# Altium schematic sheet S05_Display.SchDoc
size A4
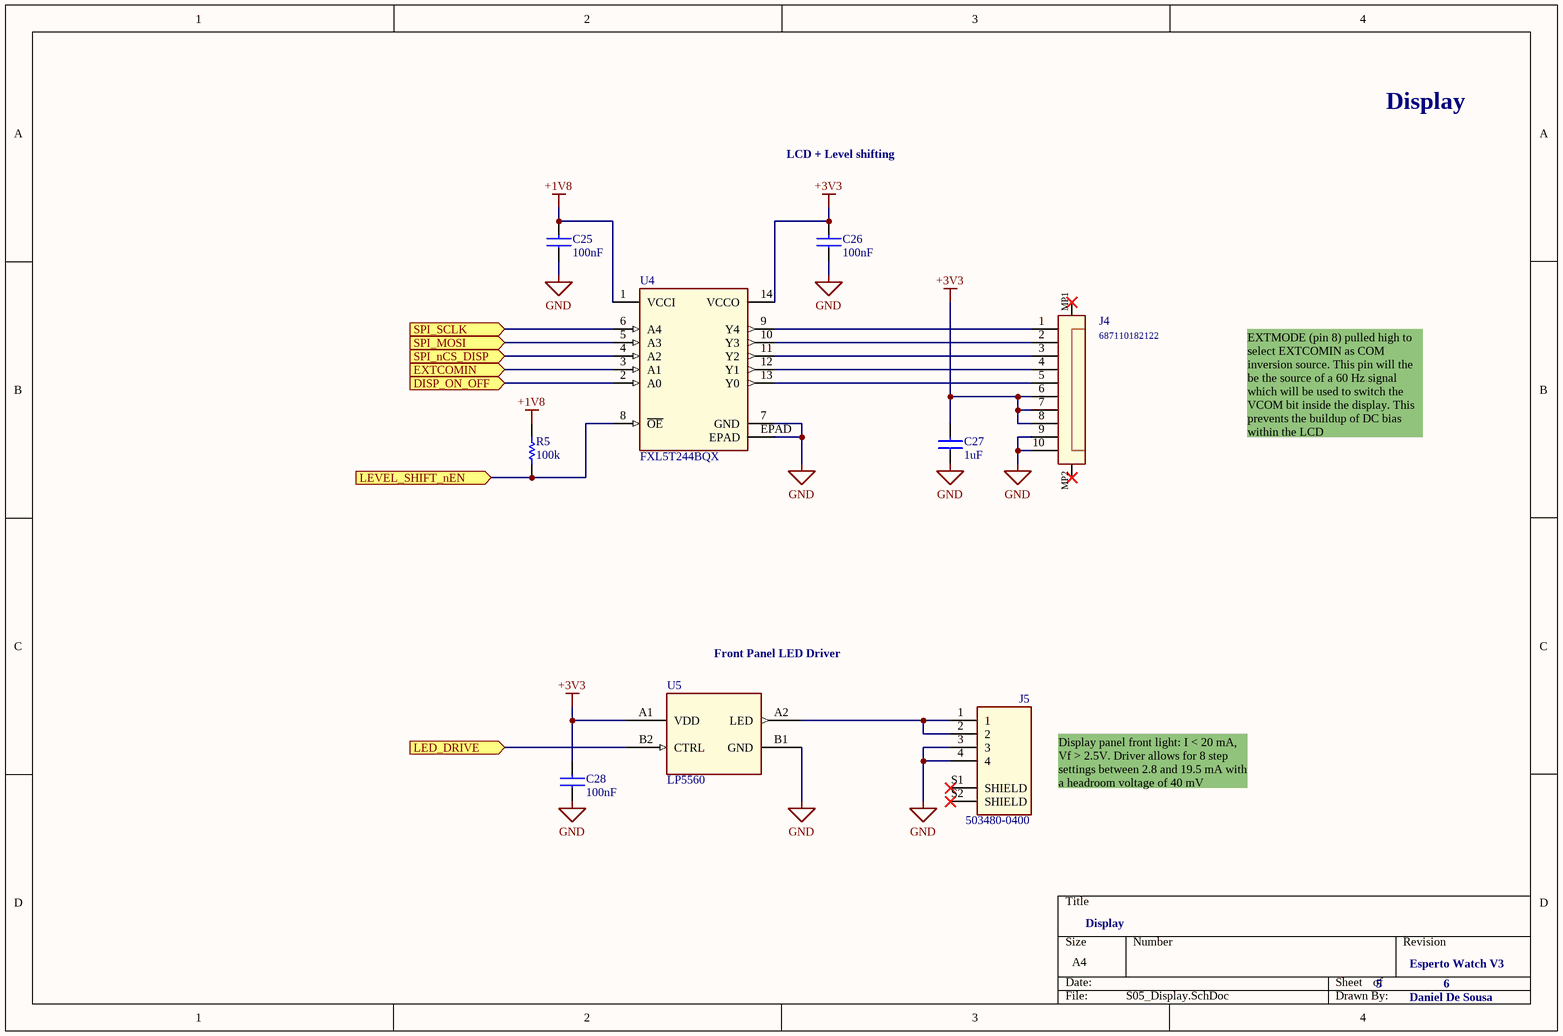
[diagram p0: S05_Display.SchDoc]

## Parts
C25  100nF  [CC_1005_0402_N]
C26  100nF  [CC_1005_0402_N]
C27  1uF  [CC_1005_0402_N]
C28  100nF  [CC_1005_0402_N]
J4  687110182122  [687110182122]
J5  503480-0400  [503480-0400]
R5  100k  [RC_1005_0402_N]
U4  FXL5T244BQX  [FXL5T244BQX]
U5  LP5560  [LP5560]

## Ports
DISP_ON_OFF (in), EXTCOMIN (in), LED_DRIVE (in), LEVEL_SHIFT_nEN (in), SPI_MOSI (in), SPI_nCS_DISP (in), SPI_SCLK (in)

## Nets
+1V8: C25.2 R5.2 U4.1(VCCI)
+3V3: C26.2 C27.2 C28.2 J4.6 J4.7 J4.8 U4.14(VCCO) U5.A1(VDD)
GND: C25.1 C26.1 C27.1 C28.1 J4.9 J4.10 J5.3 J5.4 U4.7(GND) U4.EPAD U5.B1(GND)
DISP_ON_OFF: U4.2(A0) ; port DISP_ON_OFF
EXTCOMIN: U4.3(A1) ; port EXTCOMIN
LED_DRIVE: U5.B2(CTRL) ; port LED_DRIVE
LEVEL_SHIFT_nEN: R5.1 U4.8(~{OE}) ; port LEVEL_SHIFT_nEN
SPI_MOSI: U4.5(A3) ; port SPI_MOSI
SPI_nCS_DISP: U4.4(A2) ; port SPI_nCS_DISP
SPI_SCLK: U4.6(A4) ; port SPI_SCLK
NetJ4_1: J4.1 U4.9(Y4)
NetJ4_2: J4.2 U4.10(Y3)
NetJ4_3: J4.3 U4.11(Y2)
NetJ4_4: J4.4 U4.12(Y1)
NetJ4_5: J4.5 U4.13(Y0)
NetJ5_1: J5.1 J5.2 U5.A2(LED)

Not connected (* = marked no-connect by the designer): J4 MP1* MP2*; J5 S1(SHIELD)* S2(SHIELD)*

## Notes on the sheet
- Display
- LCD + Level shifting
- EXTMODE (pin 8) pulled high to select EXTCOMIN as COM inversion source. This pin will the be the source of a 60 Hz signal which will be used to switch the VCOM bit inside the display. This prevents the buildup of DC bias within the LCD
- Front Panel LED Driver
- Display panel front light: I < 20 mA, Vf > 2.5V. Driver allows for 8 step settings between 2.8 and 19.5 mA with a headroom voltage of 40 mV
- 5
- Esperto Watch V3
- 6
- Daniel De Sousa

## Library data of the parts
C25-C28 = Capacitor
  C25 C26 C28: VALUE: 100nF
  C27: VALUE: 1uF
J4 = 687110182122: SMT ZIF Connectors WR-FPC, Horizontal, Back Locking Dual Contact, pitch 0.5 mm, 10 pins; Rated Current: 0.5 A; Contact Resistance: 30 mOhm; Withstanding Voltage: 250 VAC; Working Voltage: 50 VAC; Pin Number: 10; Pitch: 0.5 mm; ComponentLink1Description: Manufacturer; ComponentLink1URL: http://www.we-online.de; ComponentLink2Description: Datasheet; ComponentLink2URL: https://katalog.we-online.de/em/datasheet/687110182122.pdf; Part Number: 687110182122; Published Date: August 2018; Publisher: Wurth Elektronik; Operating Temperature: -55 to 85 degC; Packaging: Tape and Reel; Mounting Technology: SMT; Orientation: Horizontal; Contact Design: Back Locking Dual Contact
J5 = 503480-0400: 0.50mm Pitch Easy-On; MP: 5034800400; MF: Molex; Package: None; SnapEDA_Link: https://www.snapeda.com/parts/5034800400/Molex/view-part/?ref=snap; Digi-Key_Part_Number: WM1386CT-ND; Digi-Key_Purchase_URL: https://www.digikey.ca/product-detail/en/molex/5034800400/WM1386CT-ND/2356640?utm_source=snapeda&utm_medium=aggregator&utm_campaign=symbol; Value: *
R5 = Resistor: Value: 100k
U4 = FXL5T244BQX: Voltage Level Translator Unidirectional 1 Circuit 5 Channel; MF: ON Semiconductor; MP: FXLA108BQX; Package: DQFN-20 ON Semiconductor; Digi-Key_Purchase_URL: https://www.digikey.ca/product-detail/en/on-semiconductor/FXLA108BQX/FXLA108BQXCT-ND/2051660?utm_source=snapeda&utm_medium=aggregator&utm_campaign=symbol; Digi-Key_Part_Number: FXLA108BQXCT-ND; SnapEDA_Link: https://www.snapeda.com/parts/FXLA108BQX/ON%20Semiconductor/view-part/?ref=snap; Value: *
U5 = LP5560: Programmable Single-LED Driver; Manufacturer_Part_Number: LP5522TM/NOPB; Vendor: Texas Instruments; Built_By: EMA_UL_Team; Copyright: Copyright (C) 2018 Accelerated Designs. All rights reserved; RefDes: RefDes; Type: DEV; Value: Value